# EAGLE design 180 schematic 5 layer (EAGLE 9.6.2)
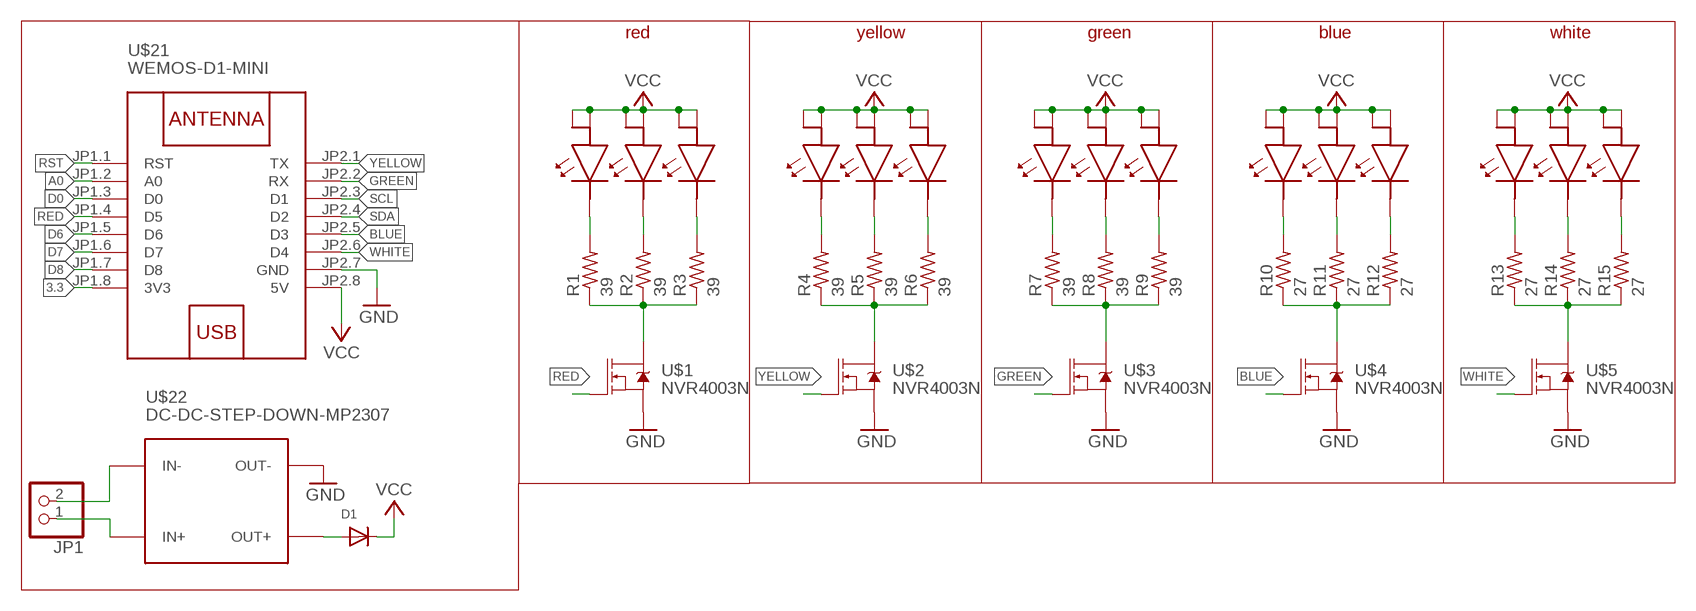
[diagram p0: schematic, sheet 1]

## Parts
D1  DIODESOD-123  [SOD-123]
JP1  PINHD-1X2  [1X02]
R1  39  R-US_R1206W  [R1206W]
R2  39  R-US_R1206W  [R1206W]
R3  39  R-US_R1206W  [R1206W]
R4  39  R-US_R1206W  [R1206W]
R5  39  R-US_R1206W  [R1206W]
R6  39  R-US_R1206W  [R1206W]
R7  39  R-US_R1206W  [R1206W]
R8  39  R-US_R1206W  [R1206W]
R9  39  R-US_R1206W  [R1206W]
R10  27  R-US_R1206W  [R1206W]
R11  27  R-US_R1206W  [R1206W]
R12  27  R-US_R1206W  [R1206W]
R13  27  R-US_R1206W  [R1206W]
R14  27  R-US_R1206W  [R1206W]
R15  27  R-US_R1206W  [R1206W]
U$1  NVR4003N  [SOT23]
U$2  NVR4003N  [SOT23]
U$3  NVR4003N  [SOT23]
U$4  NVR4003N  [SOT23]
U$5  NVR4003N  [SOT23]
U$6  5730LED  [5730LED]
U$7  5730LED  [5730LED]
U$8  5730LED  [5730LED]
U$9  5730LED  [5730LED]
U$10  5730LED  [5730LED]
U$11  5730LED  [5730LED]
U$12  5730LED  [5730LED]
U$13  5730LED  [5730LED]
U$14  5730LED  [5730LED]
U$15  5730LED  [5730LED]
U$16  5730LED  [5730LED]
U$17  5730LED  [5730LED]
U$18  5730LED  [5730LED]
U$19  5730LED  [5730LED]
U$20  5730LED  [5730LED]
U$21  WEMOS-D1-MINI  [WEMOS-D1-MINI]
U$22  DC-DC-STEP-DOWN-MP2307  [DC-DC-STEP-DOWN-MP2307]

## Nets
3.3: U$21.JP1.8(3V3)
A0: U$21.JP1.2(A0)
BLUE: U$4.2(G) U$21.JP2.5(D3)
D0: U$21.JP1.3(D0)
D6: U$21.JP1.5(D6)
D7: U$21.JP1.6(D7)
D8: U$21.JP1.7(D8)
GND: U$1.3(S) U$2.3(S) U$3.3(S) U$4.3(S) U$5.3(S) U$21.JP2.7(GND) U$22.OUT-
GREEN: U$3.2(G) U$21.JP2.2(RX)
N$1: D1.A U$22.OUT+
N$2: JP1.2 U$22.IN-
N$3: JP1.1 U$22.IN+
N$6: R1.2 U$6.P$2
N$7: R2.2 U$7.P$2
N$8: R3.2 U$8.P$2
N$9: R4.2 U$9.P$2
N$10: R5.2 U$10.P$2
N$11: R6.2 U$11.P$2
N$12: R7.2 U$12.P$2
N$13: R8.2 U$13.P$2
N$14: R10.2 U$15.P$2
N$15: R11.2 U$16.P$2
N$16: R12.2 U$17.P$2
N$17: R13.2 U$18.P$2
N$18: R14.2 U$19.P$2
N$19: R15.2 U$20.P$2
N$20: R9.2 U$14.P$2
N$21: R1.1 R2.1 R3.1 U$1.1(D)
N$22: R4.1 R5.1 R6.1 U$2.1(D)
N$23: R7.1 R8.1 R9.1 U$3.1(D)
N$24: R10.1 R11.1 R12.1 U$4.1(D)
N$25: R13.1 R14.1 R15.1 U$5.1(D)
RED: U$1.2(G) U$21.JP1.4(D5)
RST: U$21.JP1.1(RST)
SCL: U$21.JP2.3(D1)
SDA: U$21.JP2.4(D2)
VCC: D1.C U$6.P$1 U$6.P$3 U$7.P$1 U$7.P$3 U$8.P$1 U$8.P$3 U$9.P$1 U$9.P$3 U$10.P$1 U$10.P$3 U$11.P$1 U$11.P$3 U$12.P$1 U$12.P$3 U$13.P$1 U$13.P$3 U$14.P$1 U$14.P$3 U$15.P$1 U$15.P$3 U$16.P$1 U$16.P$3 U$17.P$1 U$17.P$3 U$18.P$1 U$18.P$3 U$19.P$1 U$19.P$3 U$20.P$1 U$20.P$3 U$21.JP2.8(5V)
WHITE: U$5.2(G) U$21.JP2.6(D4)
YELLOW: U$2.2(G) U$21.JP2.1(TX)

## Notes on the sheet
- red | yellow | green | blue | white

## Library data of the parts
D1 = adafruit:DIODE: Diode SMADIODE - SMA Surface Mount Package 20V 1A Schottky Diode Digikey: 641-1014-6-ND DO-1N4148 - Through Hole Small Current Diode SOD-123 20V 1 A (.5mV Vf) Schottky Diode - Digikey: MBRX120TPMSCT-ND SOD-323 10V 570mA (.38mV Vf, 3ns) Schottky Diode - Digikey: ZLLS410CT-ND SOD-523 30V 30mA Schottky Diode (RB751S-40TE61) - Digikey: RB751S-40TE61CT-ND SOT23-R/W - SOT23 Package (R = Solder Paste/Reflow Ovens, W = Hand-Soldering) BAT54Film 40V 300mA - Digikey: 497-7162-1-ND
JP1 = pinhead:PINHD-1X2: PIN HEADER
R1-R15 = resistor:R-US_: RESISTOR, American symbol
U$1-U$5 = custom parts:NVR4003N
U$6-U$20 = custom parts:5730LED
U$21 = diy-modules:WEMOS-D1-MINI: WEMOS D1 mini: Mini Wi-Fi Board based on ESP-8266 device More details can be found here: https://www.wemos.cc/product/d1-mini.html Click here to find device on ebay.com <http://www.ebay.com/sch/wemos+d1+mini+nodemcu>
U$22 = diy-modules:DC-DC-STEP-DOWN-MP2307: DC/DC Step-Down Regulator based on MP2307DN chip MP2307 datasheet available here: https://cdn-shop.adafruit.com/datasheets/MP2307_r1.9.pdf Click here to find device on ebay.com <http://www.ebay.com/sch/dc+dc+3a+mini+converter>

## Board
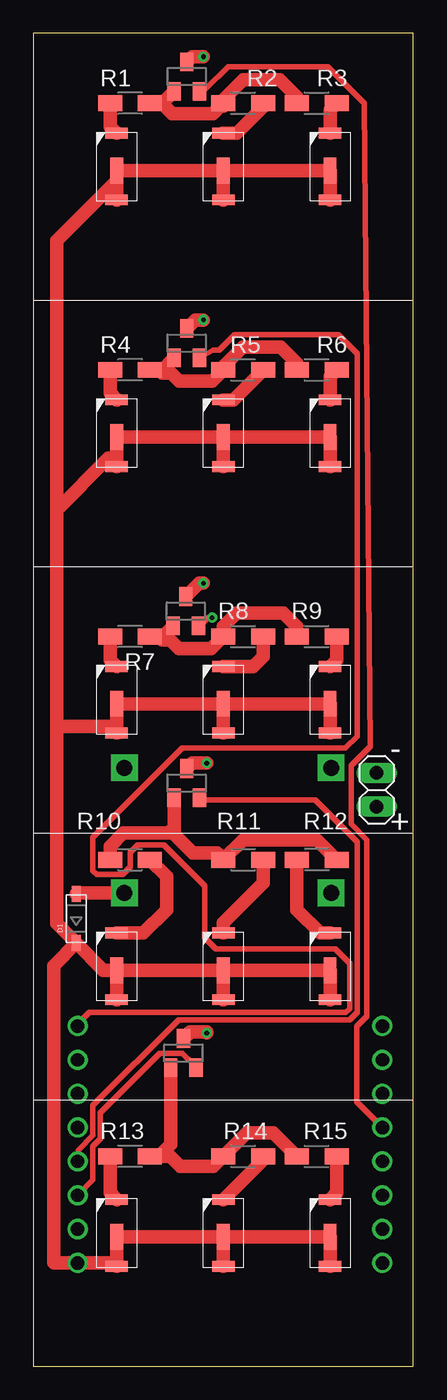
[diagram p1: board, top side]
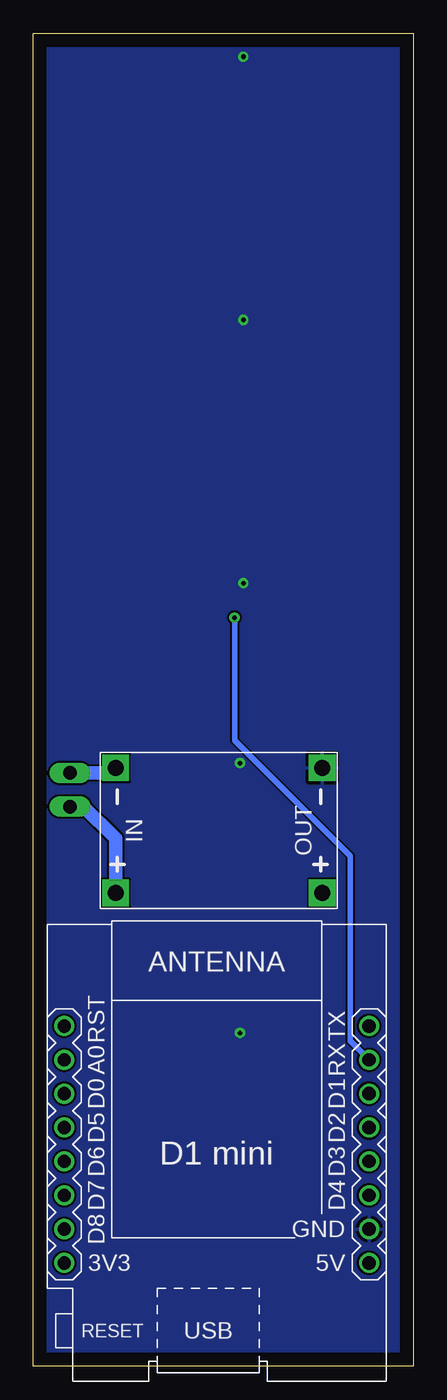
[diagram p2: board, bottom side, seen from below]

Size 28.5 x 100 mm. Coordinates in mm from the lower left corner, seen from the top.
Outline: 0,0 28.5,0 28.5,100 0,100 0,0
Copper layers (1*16): Top 0.035mm / dielectric 1.5mm / Bottom 0.035mm
Design rules "default *": minimum track width 16mil, minimum drill 0.35mm, track to track 6mil, track to pad 6mil, pad to pad 6mil, via to via 6mil, smd to smd 6mil, copper to edge 40mil, drill to drill 6mil, minimum pad ring 10mil, minimum via ring 8mil, stop-mask expansion 4mil, vias tented up to drill 0mil, thermal gap 10mil

### Footprints (pad centres in the part's own frame; a part is rotated, then mirrored left to right if it is on the bottom)
SOD-123 = smd 1.2 x 0.7: A 1.85,0; C -1.85,0
1X02 = drill 1.016 long: 1 -1.27,0; 2 1.27,0
R1206W = smd 1.8 x 1.2: 1 -1.499,0; 2 1.499,0
SOT23 = smd 1 x 1.4: 1 -0.95,-1.1; 2 0.95,-1.1; 3 0,1.1
5730LED = smd 0.813 x 1.676: P$1 -2.5,0; P$2 2.5,0 | smd 1.93 x 0.965: P$3 -0.3,0
WEMOS-D1-MINI = drill 1: JP1.1 -11.43,9.525; JP1.2 -11.43,6.985; JP1.3 -11.43,4.445; JP1.4 -11.43,1.905; JP1.5 -11.43,-0.635; JP1.6 -11.43,-3.175; JP1.7 -11.43,-5.715; JP1.8 -11.43,-8.255; JP2.1 11.43,9.525; JP2.2 11.43,6.985; JP2.3 11.43,4.445; JP2.4 11.43,1.905; JP2.5 11.43,-0.635; JP2.6 11.43,-3.175; JP2.7 11.43,-5.715; JP2.8 11.43,-8.255
DC-DC-STEP-DOWN-MP2307 = drill 1.2 pad 2 square: IN+ -7.747,-4.699; IN- -7.747,4.699; OUT+ 7.747,-4.699; OUT- 7.747,4.699

### Placement (x,y rotation side)
D1  3.22,33.59 90 top
JP1  25.75,43.25 90 top
R1  7.25,94.75 180 top
R2  15.75,94.75 0 top
R3  21.25,94.75 0 top
R4  7.25,74.75 180 top
R5  15.75,74.75 0 top
R6  21.25,74.75 0 top
R7  7.25,54.75 180 top
R8  15.75,54.75 0 top
R9  21.25,54.75 0 top
R10  7.25,38 0 top
R11  15.75,38 0 top
R12  21.25,38 180 top
R13  7.25,15.75 180 top
R14  15.75,15.75 0 top
R15  21.25,15.75 0 top
U$1  11.5,96.75 0 top
U$2  11.5,76.75 0 top
U$3  11.43,56.64 0 top
U$4  11.5,43.75 0 top
U$5  11.25,23.5 0 top
U$6  6.25,90 90 top
U$7  14.25,90 90 top
U$8  22.25,90 90 top
U$9  6.25,70 90 top
U$10  14.25,70 90 top
U$11  22.25,70 90 top
U$12  6.25,50 90 top
U$13  14.25,50 90 top
U$14  22.25,50 90 top
U$15  6.25,30 90 top
U$16  14.25,30 90 top
U$17  22.25,30 90 top
U$18  6.25,10 90 top
U$19  14.25,10 90 top
U$20  22.25,10 90 top
U$21  14.75,16 0 bottom
U$22  14.58,40.2 0 bottom

### Tracks (layer width: path | path; a pad name or v marks a point on that pad's centre or on a via)
BLUE
  Top 0.406: U$4.2 12.57,42.47 21.15,42.47 24.28,39.34 24.28,26.54 23.72,25.98 10.9,25.98 4.47,19.56 4.47,17.32 3.35,16.2 3.35,15.37 U$21.JP2.5
GND  (via drill 0.35)
  Top 1.016: U$4.3 11.9,45.25 v13,45.25 | v13,25 13,25.1 11.75,25.1 U$5.3 | U$2.3 12.15,78.5 v12.75,78.5 | U$1.3 11.9,98.25 v12.75,98.25 | U$3.3 12.44,58.75 v12.75,58.75
  pour Bottom: 0,100 0,0 28.5,0 28.5,100
GREEN  (via drill 0.35)
  Top 0.406: v13.41,56.16 13.13,56.16 12.57,55.6 U$3.2
  Bottom 0.406: v13.41,56.16 13.41,46.94 4.75,38.28 4.75,24.41 U$21.JP2.2
N$1
  Top 1.016: D1.A 3.28,35.5 U$22.OUT+
N$2
  Bottom 1.016: U$22.IN- 22.71,44.52 JP1.2
N$3
  Bottom 1.016: U$22.IN+ 22.33,39.58 24.75,42 25.73,42 JP1.1
N$6
  Top 1.016: U$6.P$2 5.75,93 R1.2
N$7
  Top 1.016: U$7.P$2 15.25,92.5 17.25,94.5 R2.2
N$8
  Top 1.016: U$8.P$2 22.25,94.25 R3.2
N$9
  Top 1.016: U$9.P$2 5.75,73 R4.2
N$10
  Top 1.016: U$10.P$2 15,72.5 R5.2
N$11
  Top 1.016: U$11.P$2 22.25,74.25 R6.2
N$12
  Top 1.016: U$12.P$2 5.75,53 R7.2
N$13
  Top 1.016: U$13.P$2 16.5,52.5 17.25,53.25 R8.2
N$14
  Top 1.016: R10.2 10,36.75 10,34.25 8.25,32.5 U$15.P$2
N$15
  Top 1.016: U$16.P$2 14.25,33.25 17.25,36.25 R11.2
N$16
  Top 1.016: R12.2 19.75,34.25 21.5,32.5 U$17.P$2
N$17
  Top 1.016: U$18.P$2 5.75,13 R13.2
N$18
  Top 1.016: R14.2 17.25,15.5 U$19.P$2
N$19
  Top 1.016: R15.2 22.75,13 U$20.P$2
N$20
  Top 1.016: U$14.P$2 22.75,53 R9.2
N$21
  Top 1.016: R3.1 19.75,95.26 18.49,96.52 15.75,96.52 14.25,95.02 R2.1 14.25,94.52 14,94.52 13.46,93.98 10.42,93.98 9.64,94.75 R1.1 9.65,94.75 U$1.1
N$22
  Top 1.016: R4.1 9.65,74.75 | 9.65,74.75 9.9,74.75 9.65,74.5 10.34,74.5 10.93,73.91 13.41,73.91 R5.1 14.25,75 15.7,76.45 18.56,76.45 19.75,75.26 R6.1 | 9.65,74.75 U$2.1
N$23
  Top 1.016: R7.1 9.69,54.75 | 9.69,54.75 9.9,54.75 9.65,54.5 10.27,54.5 10.92,53.85 13.35,53.85 R8.1 14.25,55.5 15.25,56.5 18.75,56.5 19.75,55.5 R9.1 | 9.69,54.75 U$3.1
N$24
  Top 1.016: R12.1 21.25,39.5 15.75,39.5 R11.1 13.75,38.5 11.95,38.5 10.55,39.9 U$4.1 10.55,40.4 10.15,40 6.75,40 5.75,39 R10.1
N$25
  Top 1.016: R13.1 9.4,15.75 | U$5.1 10.3,16.65 9.4,15.75 | 9.4,15.75 10.25,15.75 11,15 13.5,15 R14.1 16,17.5 18,17.5 R15.1
RED
  Top 0.406: U$1.2 12.57,95.83 12.94,95.83 14.62,97.51 22.07,97.51 24.84,94.75 25.25,46.5 23.84,45.09 23.84,40.66 25,39.5 25,26.25 24.25,25.5 24.25,19.84 U$21.JP1.4
VCC
  Top 1.016: U$7.P$1 U$7.P$3 | U$6.P$1 U$6.P$3 | U$6.P$3 U$7.P$3 | U$7.P$3 U$8.P$3 U$8.P$1 | U$10.P$1 U$10.P$3 | U$11.P$1 U$11.P$3 U$10.P$3 | U$10.P$3 U$9.P$3 U$9.P$1 5.62,68.12 1.75,64.25 | U$13.P$1 U$13.P$3 | U$14.P$1 U$14.P$3 U$13.P$3 | U$13.P$3 U$12.P$3 U$12.P$1 5.75,48 1.75,48 | D1.C 5.26,29.7 U$15.P$3 | U$15.P$3 U$15.P$1 | U$15.P$3 U$16.P$3 | U$16.P$3 U$16.P$1 | U$16.P$3 U$17.P$3 U$17.P$1 | U$19.P$3 U$18.P$3 U$18.P$1 6,7.75 U$21.JP2.8 1.53,7.75 1.53,29.72 1.52,29.73 1.52,30.04 D1.C | U$19.P$3 U$19.P$1 | U$19.P$3 U$20.P$3 U$20.P$1 | D1.C 1.75,33.21 1.75,48 | 1.75,48 1.75,64.25 | 1.75,64.25 1.75,84.45 6.25,88.95 U$6.P$3
WHITE
  Top 0.406: U$5.2 12.01,22.63 11.18,23.47 9.5,23.47 5.03,19 5.03,17.04 4.47,16.48 4.47,13.97 3.35,12.85 U$21.JP2.6
YELLOW
  Top 0.406: U$2.2 13.48,76.22 13.94,76.22 15.12,77.39 22.85,77.39 24.28,75.97 24.28,47.25 23.41,46.38 11.18,46.38 4.47,39.67 4.47,37.16 4.75,36.88 6.71,36.88 7.26,37.44 7.26,38.56 7.82,39.12 9.78,39.12 12.85,36.04 12.85,32.13 13.69,31.29 22.63,31.29 23.72,30.2 23.72,26.82 23.44,26.54 4.19,26.54 3.35,25.7 U$21.JP2.1

### Text on the board
tPlace: - | +